# EAGLE design CTH (EAGLE 6.5.0)
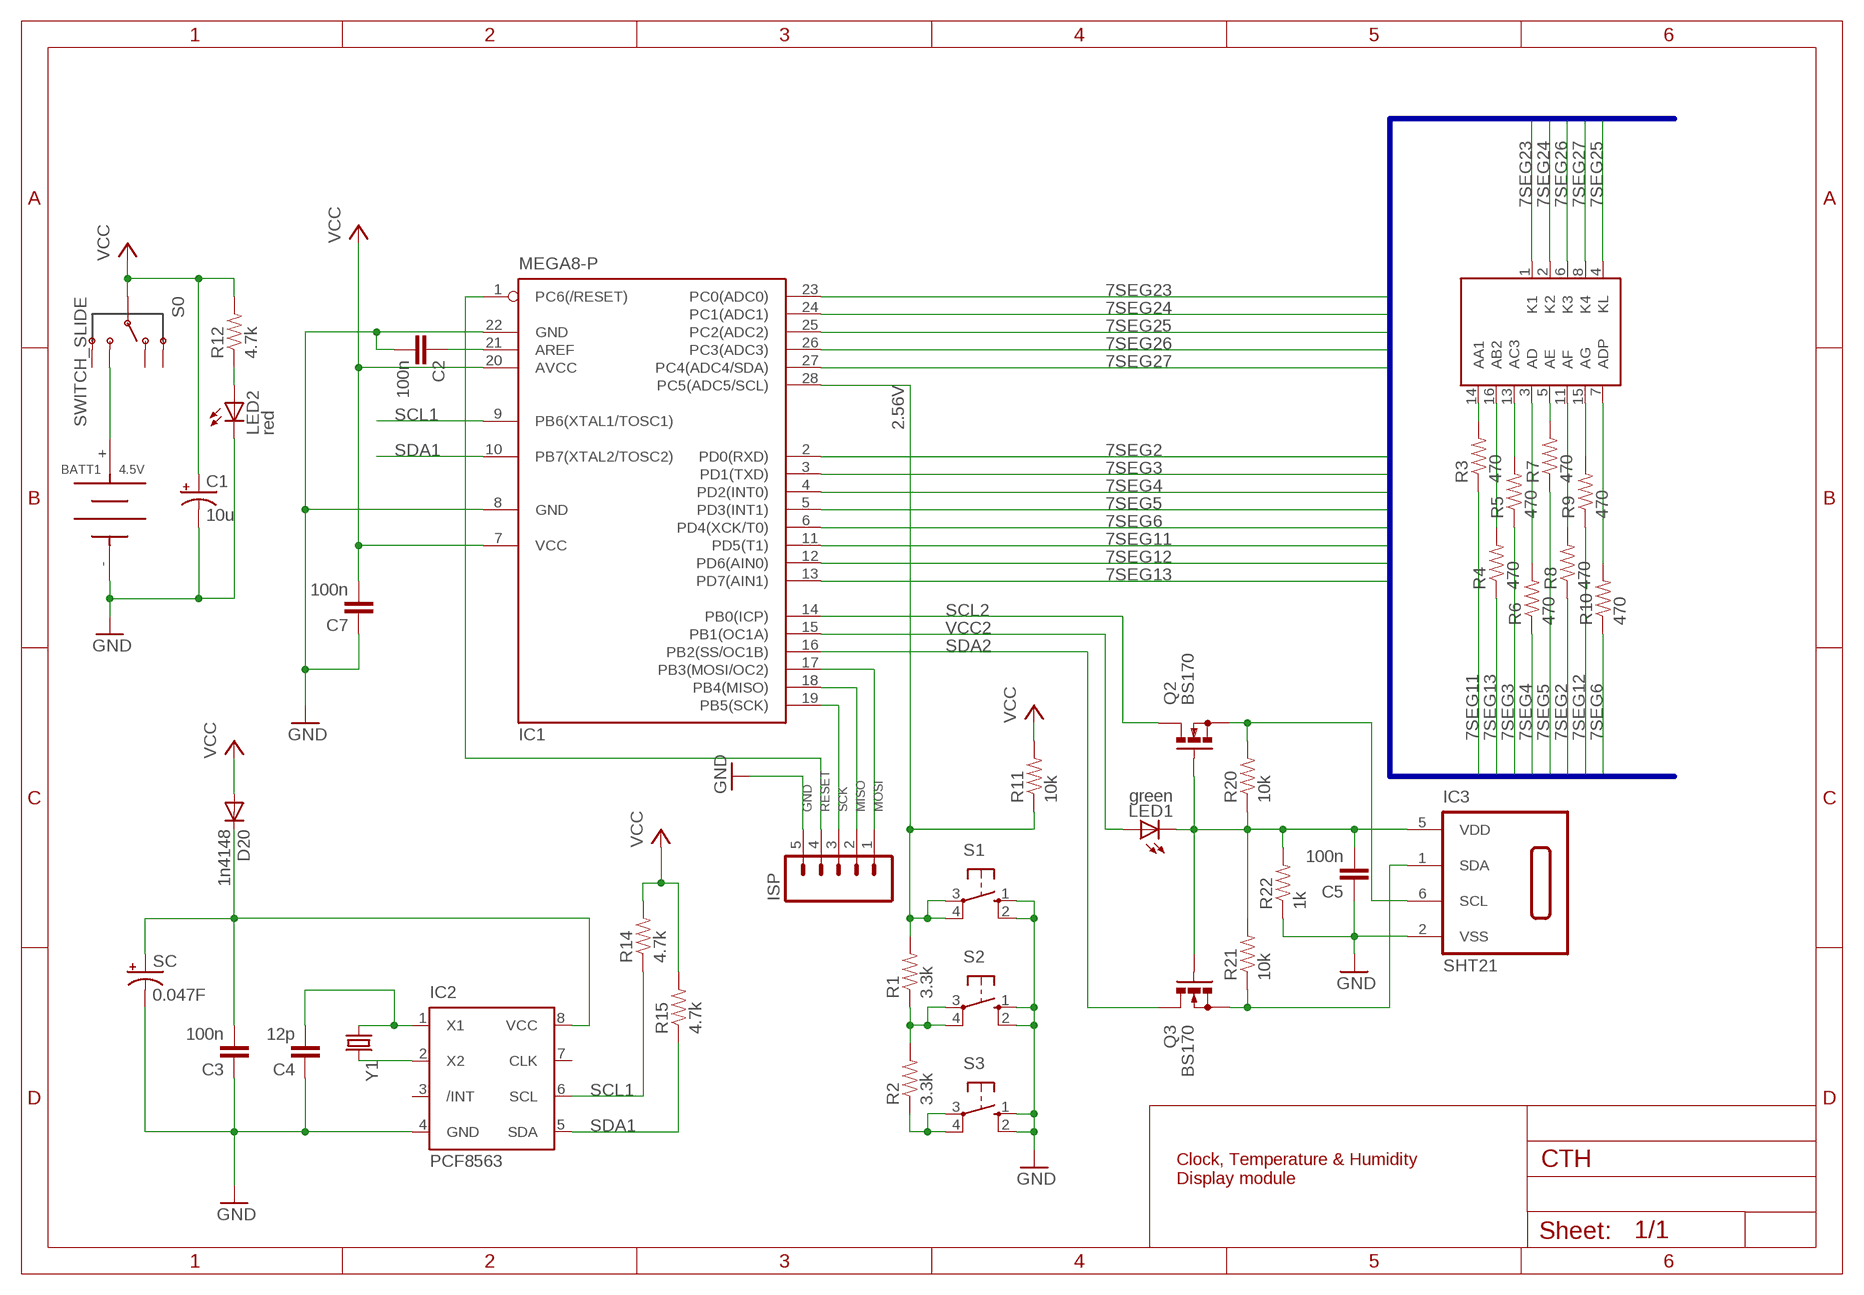
[diagram p0: schematic, sheet 1]

## Parts
7SEG  LTC-4027JRLTC-4027JR  [LTC-4727JR]
BATT1  1291-[2-56]  [1291]
C1  10u  CAP_POLPTH2  [CPOL-RADIAL-10UF-25V]
C2  100n  CAP0805  [0805]
C3  100n  CAP0805  [0805]
C4  12p  CAP0805  [0805]
C5  100n  CAP0805  [0805]
C7  100n  CAP0805  [0805]
D20  1n4148  DIODE-SOD80C  [SOD80C]
IC1  MEGA8-P  [DIL28-3]
IC2  PCF8563  [DS1307_PCF8583_DIL08]
IC3  SHT21  [DFN6/SHT]
ISP  M05PTH  [1X05]
LED1  green  SPARKFUN_LED1206  [SPARKFUN_LED-1206]
LED2  red  LED3MM  [LED3MM]
Q2  BS170  [SOT54E]
Q3  BS170  [SOT54E]
R1  3.3k  RESISTOR0805-RES  [0805]
R2  3.3k  RESISTOR0805-RES  [0805]
R3  470  RESISTOR0805-RES  [0805]
R4  470  RESISTOR0805-RES  [0805]
R5  470  RESISTOR0805-RES  [0805]
R6  470  RESISTOR0805-RES  [0805]
R7  470  RESISTOR0805-RES  [0805]
R8  470  RESISTOR0805-RES  [0805]
R9  470  RESISTOR0805-RES  [0805]
R10  470  RESISTOR0805-RES  [0805]
R11  10k  RESISTOR0805-RES  [0805]
R12  4.7k  RESISTOR0805-RES  [0805]
R14  4.7k  RESISTOR0805-RES  [0805]
R15  4.7k  RESISTOR0805-RES  [0805]
R20  10k  RESISTOR0805-RES  [0805]
R21  10k  RESISTOR0805-RES  [0805]
R22  1k  RESISTOR0805-RES  [0805]
S0  SWITCH_SLIDE  [SWITCH_SLIDE]
S1  10-XX  [B3F-10XX]
S2  10-XX  [B3F-10XX]
S3  10-XX  [B3F-10XX]
SC  0.047F  SUPERCAP_0.047F  [SUPERCAP_0.047F]
Y1  CRYSTALTC38H  [TC38H]

## Nets
2.56V: IC1.28(PC5(ADC5/SCL)) R1.2 R11.1 S1.3(P) S1.4(P1)
7SEG2: IC1.2(PD0(RXD)) R8.1
7SEG3: IC1.3(PD1(TXD)) R5.1
7SEG4: IC1.4(PD2(INT0)) R6.1
7SEG5: IC1.5(PD3(INT1)) R7.1
7SEG6: IC1.6(PD4(XCK/T0)) R10.1
7SEG11: IC1.11(PD5(T1)) R3.1
7SEG12: IC1.12(PD6(AIN0)) R9.1
7SEG13: IC1.13(PD7(AIN1)) R4.1
7SEG23: 7SEG.1(K1) IC1.23(PC0(ADC0))
7SEG24: 7SEG.2(K2) IC1.24(PC1(ADC1))
7SEG25: 7SEG.4(KL) IC1.25(PC2(ADC2))
7SEG26: 7SEG.6(K3) IC1.26(PC3(ADC3))
7SEG27: 7SEG.8(K4) IC1.27(PC4(ADC4/SDA))
GND: BATT1.- C1.2(-) C2.2 C3.1 C4.1 C5.1 C7.1 IC1.8(GND) IC1.22(GND) IC2.4(GND) IC3.2(VSS) ISP.5 LED2.K(C) R22.1 S1.1(S) S1.2(S1) S2.1(S) S2.2(S1) S3.1(S) S3.2(S1) SC.2(-)
MISO: IC1.18(PB4(MISO)) ISP.2
MOSI: IC1.17(PB3(MOSI/OC2)) ISP.1
N$1: 7SEG.14(AA1) R3.2
N$2: 7SEG.16(AB2) R4.2
N$3: 7SEG.13(AC3) R5.2
N$4: BATT1.+ S0.E
N$5: 7SEG.3(AD) R6.2
N$6: 7SEG.5(AE) R7.2
N$7: 7SEG.11(AF) R8.2
N$8: 7SEG.15(AG) R9.2
N$9: 7SEG.7(ADP) R10.2
N$10: IC2.2(X2) Y1.2
N$11: C2.1 IC1.21(AREF)
N$12: C5.2 IC3.5(VDD) LED1.C Q2.G Q3.G R20.1 R21.2 R22.2
N$13: LED2.A R12.1
N$15: IC3.1(SDA) Q3.S R21.1
N$16: R2.1 S3.3(P) S3.4(P1)
N$17: C4.2 IC2.1(X1) Y1.1
N$18: R1.1 R2.2 S2.3(P) S2.4(P1)
N$19: IC3.6(SCL) Q2.S R20.2
RESET: IC1.1(PC6(/RESET)) ISP.4
SCK: IC1.19(PB5(SCK)) ISP.3
SCL1: IC1.9(PB6(XTAL1/TOSC1)) IC2.6(SCL) R14.1
SCL2: IC1.14(PB0(ICP)) Q2.D
SDA1: IC1.10(PB7(XTAL2/TOSC2)) IC2.5(SDA) R15.1
SDA2: IC1.16(PB2(SS/OC1B)) Q3.D
VCC: C1.1(+) C7.2 D20.A IC1.7(VCC) IC1.20(AVCC) R11.2 R12.2 R14.2 R15.2 S0.M
VCC2: IC1.15(PB1(OC1A)) LED1.A
VCC_RTC [VCC]: C3.2 D20.C IC2.8(VCC) SC.1(+)
Unconnected: IC2.3(/INT) IC2.7(CLK) S0.D S0.HOLD1 S0.HOLD2

## Buses
7SEG[1..28]

## Notes on the sheet
- Clock, Temperature & Humidity
  Display module

## Library data of the parts
7SEG = LTC-4727JR:LTC-4027JR
BATT1 = Keystone-Electronics:1291
C1 = SparkFun:CAP_POL: Capacitor Polarized These are standard SMD and PTH capacitors. Normally 10uF, 47uF, and 100uF in electrolytic and tantalum varieties. Always verify the external diameter of the through hole cap, it varies with capacity, voltage, and manufacturer. The EIA devices should be standard.
C2-C5 C7 = SparkFun:CAP: Capacitor Standard 0603 ceramic capacitor, and 0.1" leaded capacitor.
D20 = diode:DIODE-: DIODE
IC1 = atmel:MEGA8-P: MICROCONTROLLER 8 Kbytes FLASH, 1 kbytes SRAM, 512 bytes EEPROM, USART, 4-channel 10 bit ADC, 2-channel 8 bit ADC Pin compatible with Atmega48, ATMega88, ATMega168 Source: avr.lbr; OC_FARNELL: unknown; OC_NEWARK: unknown
IC2 = Fluid_Clock:PCF8563: RCT
IC3 = sensirion:SHT21: Humidity and Temperature Sensor
ISP = SparkFun:M05: Header 5 Standard 5-pin 0.1" header. Use with straight break away headers (SKU : PRT-00116), right angle break away headers (PRT-00553), swiss pins (PRT-00743), machine pins (PRT-00117), and female headers (PRT-00115). Molex polarized connector foot print use with SKU : PRT-08230 with associated crimp pins and housings.
LED1 = Fluid_Clock:SPARKFUN_LED: LEDs Standard schematic elements and footprints for 5mm, 3mm, 1206, and 0603 sized LEDs. 5mm - Spark Fun Electronics SKU : COM-00529 (and others)
LED2 = SparkFun:LED: LEDs Standard schematic elements and footprints for 5mm, 3mm, 1206, and 0603 sized LEDs. 5mm - Spark Fun Electronics SKU : COM-00529 (and others)
Q2 Q3 = transistor-small-signal:BS170: N-CHANNEL MOS FET
R1-R12 R14 R15 R20-R22 = SparkFun:RESISTOR: Resistor Basic schematic elements and footprints for 0603, 1206, and PTH resistors.
S0 = SparkFun:SWITCH_SLIDE
S1-S3 = switch-omron:10-XX: OMRON SWITCH; MPN: B3F-1000; OC_FARNELL: 176432; OC_NEWARK: 36M3542
SC = Fluid_Clock:SUPERCAP_0.047F: supercap
Y1 = SparkFun:CRYSTAL: Crystals Various standard crystals. Proven footprints. Spark Fun Electronics SKU : COM-00534

## Net classes
0 default: width 0.35 mm
3 VCC: width 0.35 mm
4 GND: width 0.35 mm

## Board
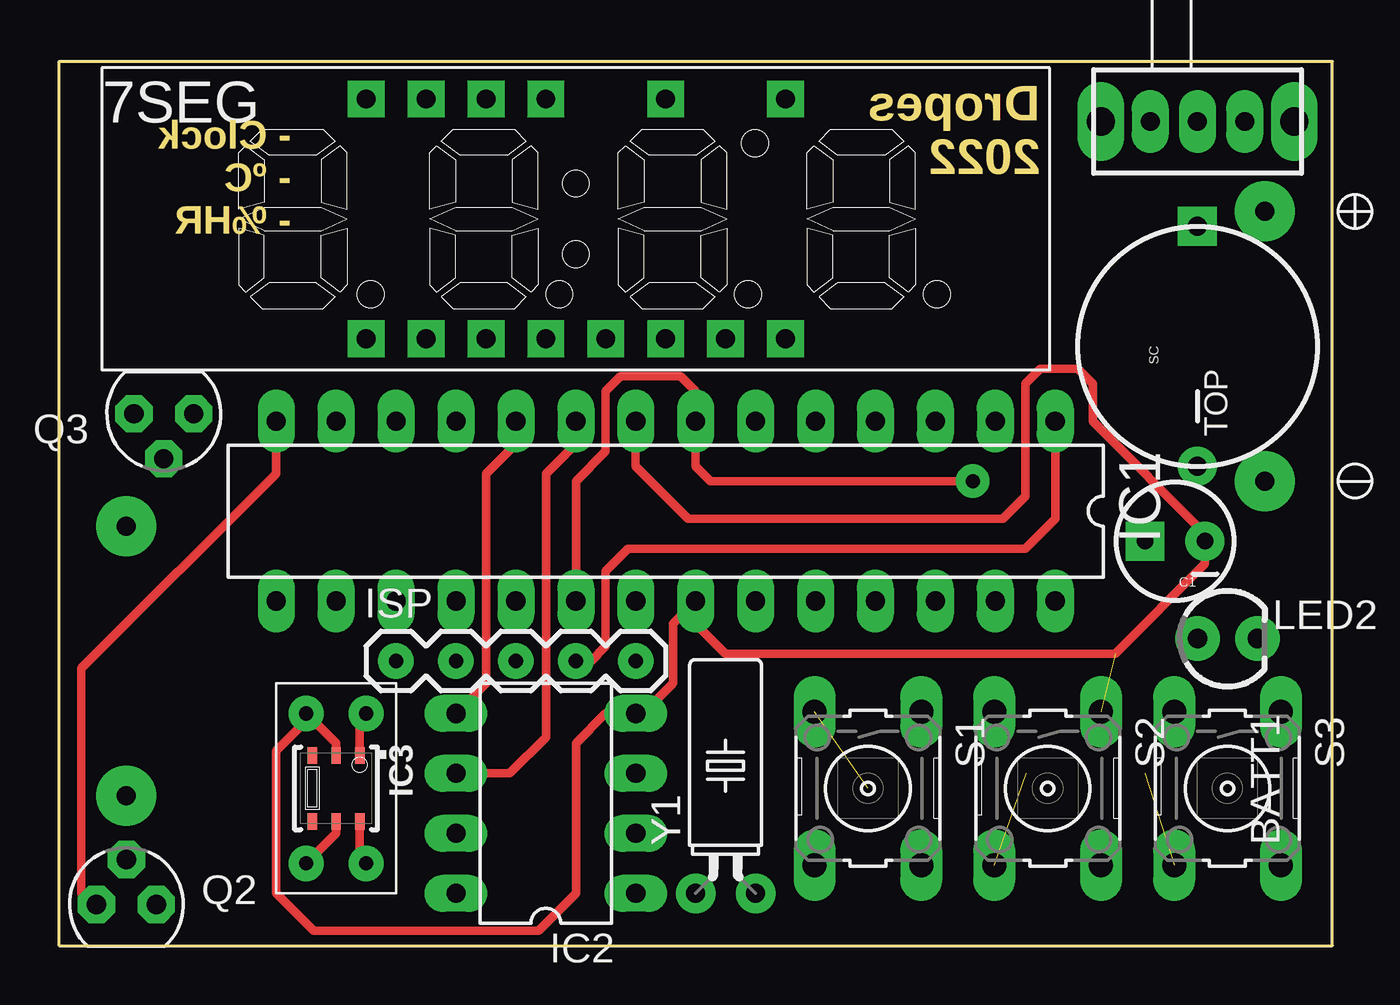
[diagram p1: board, top side]
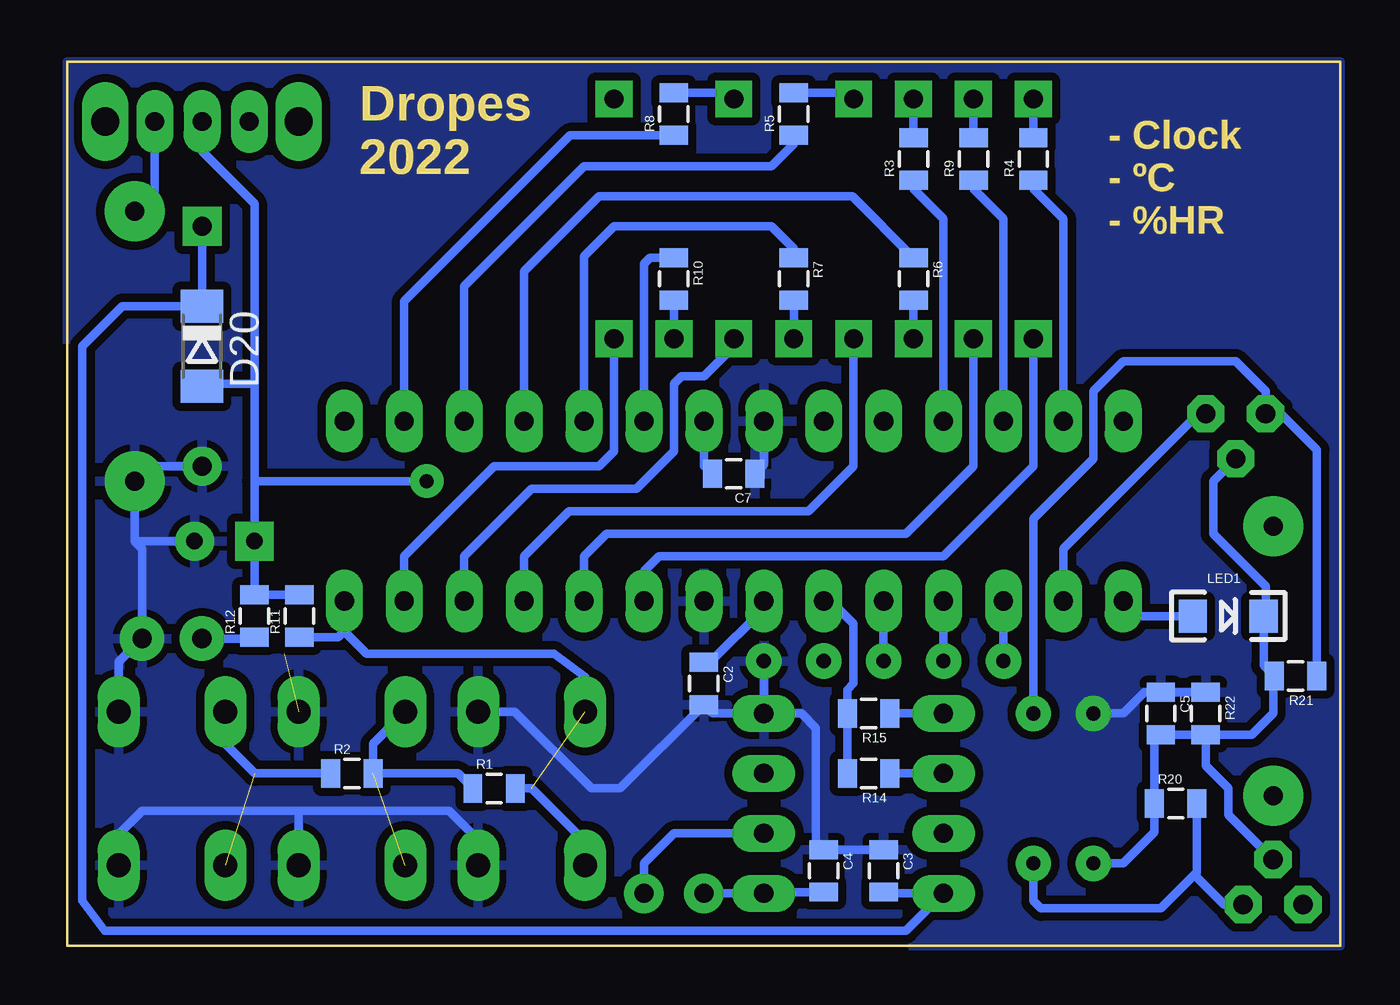
[diagram p2: board, bottom side, seen from below]

Size 53.97 x 37.47 mm. Coordinates in mm from the lower left corner, seen from the top.
Outline: 0,0 53.97,0 53.97,37.47 0,37.47 0,0
Copper layers (1*16): Top 0.035mm / dielectric 1.5mm / Bottom 0.035mm
Design rules "DROPES_microscope *": minimum track width 0.35mm, minimum drill 0.6mm, track to track 0.35mm, track to pad 0.35mm, pad to pad 0.3mm, via to via 0.3mm, smd to smd 0mil, copper to edge 0mil, drill to drill 8mil, minimum pad ring 15mil, minimum via ring 8mil, stop-mask expansion 4mil, vias tented up to drill 0mil, thermal gap 0.3mm

### Footprints (pad centres in the part's own frame; a part is rotated, then mirrored left to right if it is on the bottom)
LTC-4727JR = drill 0.8 square: 1 -8.89,-5.08; 2 -6.35,-5.08; 3 -3.81,-5.08; 4 -1.27,-5.08; 5 1.27,-5.08; 6 3.81,-5.08; 7 6.35,-5.08; 8 8.89,-5.08; 9 8.89,5.08; 11 3.81,5.08; 13 -1.27,5.08; 14 -3.81,5.08; 15 -6.35,5.08; 16 -8.89,5.08
1291 = drill 0.8 pad 2.54: + 24.13,12.383; - 24.13,0.953; -1 -24.13,-0.953; -2 -24.13,-12.383
CPOL-RADIAL-10UF-25V = drill 0.7 pad 1.651 square: 1 1.27,0 | drill 0.7 pad 1.651: 2 -1.27,0
0805 = smd 0.8 x 1.2: 1 -0.9,0; 2 0.9,0
SOD80C = smd 1.4 x 1.8: A 1.7,0; C -1.7,0
DIL28-3 = drill 0.813 long: 1 -16.51,-3.81; 2 -13.97,-3.81; 3 -11.43,-3.81; 4 -8.89,-3.81; 5 -6.35,-3.81; 6 -3.81,-3.81; 7 -1.27,-3.81; 8 1.27,-3.81; 9 3.81,-3.81; 10 6.35,-3.81; 11 8.89,-3.81; 12 11.43,-3.81; 13 13.97,-3.81; 14 16.51,-3.81; 15 16.51,3.81; 16 13.97,3.81; 17 11.43,3.81; 18 8.89,3.81; 19 6.35,3.81; 20 3.81,3.81; 21 1.27,3.81; 22 -1.27,3.81; 23 -3.81,3.81; 24 -6.35,3.81; 25 -8.89,3.81; 26 -11.43,3.81; 27 -13.97,3.81; 28 -16.51,3.81
DS1307_PCF8583_DIL08 = drill 0.813 long: 1 -3.81,-3.81; 2 -1.27,-3.81; 3 1.27,-3.81; 4 3.81,-3.81; 5 3.81,3.81; 6 1.27,3.81; 7 -1.27,3.81; 8 -3.81,3.81
DFN6/SHT = smd 0.4 x 0.7: 1 -1,-1.4; 2 0,-1.4; 3 1,-1.4; 4 1,1.4; 5 0,1.4; 6 -1,1.4
1X05 = drill 0.6 pad 1.5: 1 0,0; 2 2.54,0; 3 5.08,0; 4 7.62,0; 5 10.16,0
SPARKFUN_LED-1206 = smd 1.2 x 1.4: A -1.5,0; C 1.5,0
LED3MM = drill 0.813 pad 1.88: A -1.27,0; K 1.27,0
SOT54E = drill 0.813 octagon: D -1.27,0; G 0,1.905; S 1.27,0
SWITCH_SLIDE = drill 1.2 pad 1.7 long: 3 -4.1,0; HOLD1 -4.1,0; HOLD2 4.1,0 | drill 0.8 pad 1.5 long: D 2,0; E -2,0; M 0,0
B3F-10XX = drill 1.016 long: 1 -3.251,2.261; 2 3.251,2.261; 3 -3.251,-2.261; 4 3.251,-2.261
SUPERCAP_0.047F = drill 0.8 pad 1.651 square: 1 5.08,0 | drill 0.8 pad 1.651: 2 -5.08,0
TC38H = drill 0.813 pad 1.676: 1 -1.27,0; 2 1.27,0

### Placement (x,y rotation side)
7SEG  21.91,30.8 0 top
BATT1  26.99,18.73 0 top
C1  47.31,17.15 180 top
C2  26.99,11.11 270 bottom
C3  19.37,3.18 270 bottom
C4  21.91,3.18 270 bottom
C5  7.62,9.84 270 bottom
C7  25.72,20 180 bottom
D20  48.26,25.4 270 bottom
IC1  25.72,18.42 180 top
IC2  20.64,6.03 90 top
IC3  11.75,6.67 180 top
ISP  14.29,12.06 0 top
LED1  4.76,13.97 0 bottom
LED2  49.53,13.02 0 top
Q2  2.86,1.75 0 top
Q3  4.45,22.54 180 top
R1  35.88,6.67 0 bottom
R2  41.91,7.3 0 bottom
R3  18.1,33.34 90 bottom
R4  13.02,33.34 90 bottom
R5  23.18,35.24 90 bottom
R6  18.1,28.26 270 bottom
R7  23.18,28.26 270 bottom
R8  28.26,35.24 90 bottom
R9  15.56,33.34 90 bottom
R10  28.26,28.26 270 bottom
R11  44.13,13.97 90 bottom
R12  46.04,13.97 90 bottom
R14  20,7.3 180 bottom
R15  20,9.84 180 bottom
R20  6.98,6.03 0 bottom
R21  1.91,11.43 180 bottom
R22  5.71,9.84 270 bottom
S0  48.26,34.93 180 top
S1  34.29,6.67 270 top
S2  41.91,6.67 270 top
S3  49.53,6.67 270 top
SC  48.26,25.4 90 top
Y1  28.26,2.22 0 top

### Tracks (layer width: path | path; a pad name or v marks a point on that pad's centre or on a via)
2.56V  (1 unrouted)
  Bottom 0.35: S1.3 32.03,11.39 33.34,12.38 41.28,12.38 42.23,13.33 | R1.2 34.29,6.67 32.03,4.41 S1.4 | 42.23,13.33 IC1.28 | R11.1 42.49,13.07 42.23,13.33
7SEG2
  Bottom 0.35: R8.1 32.65,34.34 39.69,27.3 IC1.2
7SEG3
  Bottom 0.35: R5.1 23.18,33.97 24.13,33.02 32.07,33.02 37.15,27.94 IC1.3
7SEG4
  Bottom 0.35: IC1.4 34.61,28.58 31.43,31.75 20.69,31.75 R6.1
7SEG5
  Bottom 0.35: R7.1 23.18,29.53 24.13,30.48 30.8,30.48 32.07,29.21 IC1.5
7SEG6
  Bottom 0.35: R10.1 29.26,29.16 29.53,28.89 IC1.6
7SEG11
  Bottom 0.35: R3.1 18.1,32.07 16.83,30.8 IC1.11
7SEG12
  Bottom 0.35: R9.1 15.56,32.07 14.29,30.8 IC1.12
7SEG13
  Bottom 0.35: R4.1 13.02,32.07 11.75,30.8 IC1.13
7SEG23
  Bottom 0.35: 7SEG.1 13.02,20.32 16.83,16.51 28.89,16.51 29.53,15.87 IC1.23
7SEG24
  Bottom 0.35: 7SEG.2 15.56,20.32 18.41,17.46 31.11,17.46 32.07,16.51 IC1.24
7SEG25
  Bottom 0.35: IC1.25 34.61,16.51 32.7,18.42 22.54,18.42 20.64,20.32 7SEG.4
7SEG26
  Bottom 0.35: IC1.26 37.15,16.51 34.29,19.37 29.85,19.37 28.26,20.96 28.26,23.81 27.94,24.13 26.99,24.13 25.72,25.4 7SEG.6
7SEG27
  Bottom 0.35: 7SEG.8 30.8,20.96 31.43,20.32 35.88,20.32 39.69,16.51 IC1.27
GND  (via drill 0.6 pad 1.5)  (1 unrouted)
  Top 0.35: IC3.2 11.75,8.57 v10.48,9.84 10.48,9.53 9.21,8.25 9.21,2.22 10.8,0.64 20.32,0.64 21.91,2.22 21.91,8.57 23.18,9.84 IC2.4 24.77,9.84 26.04,11.11 26.04,13.65 IC1.22 26.99,13.65 28.26,12.38 44.77,12.38 48.58,16.19 C1.2 48.58,17.46 43.82,22.22 43.82,23.81 43.18,24.45 41.59,24.45 40.96,23.81 40.96,19.05 40,18.1 26.67,18.1 24.45,20.32 IC1.8
  Bottom 0.35: S1.2 36.55,4.48 37.78,5.72 44.17,5.72 | 44.17,5.72 50.8,5.72 51.79,4.72 S3.2 | S2.2 44.17,5.72 | S3.1 51.79,12.03 LED2.K 50.8,16.83 51.12,17.15 | IC2.4 22.86,9.84 22.23,9.21 22.23,4.39 C4.1 C3.1 | C7.1 24.45,20.37 IC1.8 | R22.1 C5.1 8.31,10.74 9.21,9.84 v10.48,9.84 | SC.2 50.8,20.32 BATT1.- 51.12,17.15 | C1.2 51.12,17.15 | S1.1 35,9.92 31.75,6.67 30.53,6.67 C2.2 26.62,9.84 IC2.4 | ISP.5 IC2.4
  pour Bottom: 0,0 0,37.47 53.97,37.47 53.97,0
MISO
  Bottom 0.35: IC1.18 ISP.2
MOSI
  Bottom 0.35: IC1.17 ISP.1
N$1
  Bottom 0.35: R3.2 7SEG.14
N$2
  Bottom 0.35: R4.2 7SEG.16
N$3
  Bottom 0.35: R5.2 20.9,36.14 7SEG.13
N$4
  Bottom 0.35: S0.E 50.26,31.97 BATT1.+
N$5
  Bottom 0.35: 7SEG.3 R6.2
N$6
  Bottom 0.35: 7SEG.5 R7.2
N$7
  Bottom 0.35: R8.2 25.98,36.14 7SEG.11
N$8
  Bottom 0.35: R9.2 7SEG.15
N$9
  Bottom 0.35: 7SEG.7 R10.2
N$10
  Bottom 0.35: IC2.2 28.26,4.76 29.53,3.49 Y1.2
N$11
  Bottom 0.35: C2.1 26.72,12.01 24.45,14.29 IC1.21
N$12  (via drill 0.6 pad 1.5)
  Top 0.35: IC3.5 11.75,4.76 v10.48,3.49
  Bottom 0.35: R22.2 C5.2 7.88,8.68 R20.1 7.88,4.81 9.21,3.49 v10.48,3.49 | Q3.G 5.4,19.69 5.4,17.46 3.17,15.24 3.17,14.06 LED1.C 3.26,11.89 R21.2 2.86,11.38 2.86,9.84 3.76,8.94 R22.2 | R22.2 5.72,7.62 4.76,6.67 4.76,5.56 Q2.G
N$13
  Bottom 0.35: R12.1 46.09,13.02 LED2.A
N$15  (via drill 0.6 pad 1.5)
  Top 0.35: IC3.1 12.75,9.57 v13.02,9.84
  Bottom 0.35: v13.02,9.84 13.02,18.1 10.48,20.64 10.48,23.49 9.21,24.76 4.45,24.76 3.17,23.49 Q3.S 2.54,22.54 1.01,21.01 R21.1
N$16  (1 unrouted)
  Bottom 0.35: R2.1 46.04,7.3 47.31,8.57 47.27,8.61 S3.3
N$17
  Bottom 0.35: Y1.1 IC2.1 24.45,2.27 C4.2
N$18  (1 unrouted)
  Bottom 0.35: R1.1 37.41,7.3 R2.2 41.01,8.56 S2.3
N$19  (via drill 0.6 pad 1.5)
  Top 0.35: IC3.6 12.75,3.76 v13.02,3.49
  Bottom 0.35: R20.2 6.08,3.12 6.19,3.02 | 6.19,3.02 7.62,1.59 12.7,1.59 13.02,1.91 v13.02,3.49 | Q2.S 4.92,1.75 6.19,3.02
N$20  (via drill 0.6 pad 1.5)
  other vias: 13.02,3.49
RESET
  Top 0.35: ISP.4 22.54,12.06 23.18,12.7 23.18,15.87 24.13,16.83 40.96,16.83 42.23,18.1 IC1.1
SCK
  Bottom 0.35: IC1.19 ISP.3
SCL1
  Top 0.35: IC2.6 R14.1 20.64,8.84 20.64,20 21.91,21.27 IC1.9
  Bottom 0.35: R14.1 IC2.6
SCL2
  Top 0.35: Q2.D 0.95,2.22 0.95,11.75 9.21,20 IC1.14
SDA1
  Top 0.35: IC2.5 18.1,11.11 18.1,20 19.37,21.27 IC1.10
  Bottom 0.35: R15.1 IC2.5
SDA2
  Bottom 0.35: Q3.D 6.03,22.54 11.75,16.83 IC1.16
VCC  (via drill 0.6 pad 1.42)
  Top 0.35: IC1.20 21.91,19.69 23.18,20.96 23.18,23.49 23.81,24.13 26.35,24.13 26.99,23.49 IC1.7 26.99,20.32 27.62,19.69 v38.74,19.69
  Bottom 0.35: S0.M 48.26,33.65 46.04,31.43 46.04,23.81 | 46.04,23.81 46.04,19.69 | 46.04,19.69 C1.1 R12.2 R11.2 | C7.2 26.99,20.37 | 26.99,20.37 IC1.7 | 20.95,9.89 R15.2 | R15.2 R14.2 | 26.99,20.37 26.99,20.32 | IC1.20 21.59,14.6 20.64,13.65 20.64,11.11 20.9,10.85 R15.2 | v38.74,19.69 46.04,19.69 | D20.A 48.15,23.81 46.04,23.81
VCC2
  Bottom 0.35: IC1.15 8.57,13.97 LED1.A
VCC_RTC
  Bottom 0.35: C3.2 19.32,2.22 IC2.8 18.41,0.64 52.39,0.64 53.34,1.91 53.34,25.4 51.64,27.1 D20.C SC.1

### Text on the board
Dimension: Dropes / 2022 | - Clock / - ºC / - %HR